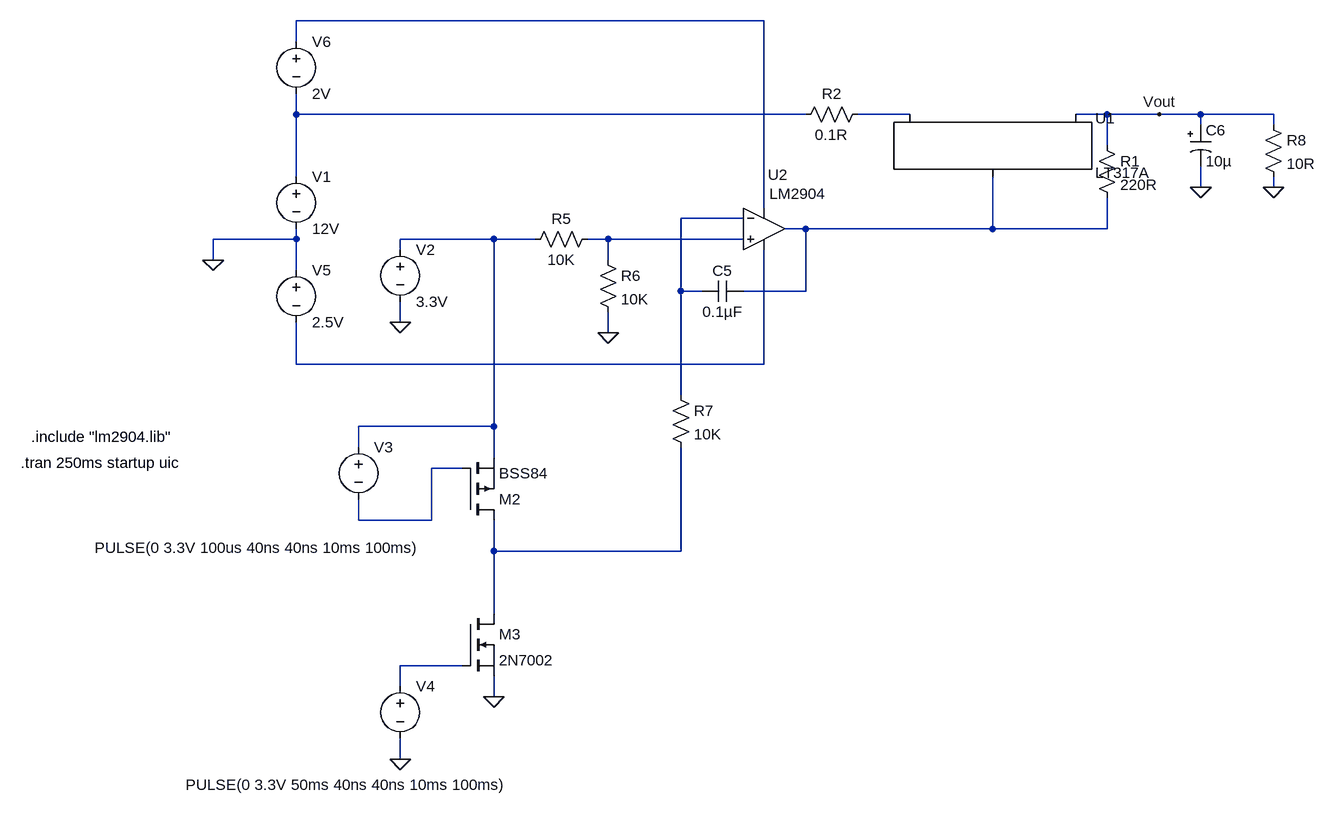
[diagram p0: schematic adj linear regulator minus current sense.asc]
adj linear regulator minus current sense.asc, the LTspice schematic file:
Version 4
SHEET 1 1336 820
WIRE 112 -512 -608 -512
WIRE -608 -480 -608 -512
WIRE -608 -368 -608 -400
WIRE 176 -368 -608 -368
WIRE 336 -368 256 -368
WIRE 640 -368 592 -368
WIRE 720 -368 640 -368
WIRE 784 -368 720 -368
WIRE 896 -368 784 -368
WIRE 784 -352 784 -368
WIRE 896 -352 896 -368
WIRE 640 -320 640 -368
WIRE -608 -272 -608 -368
WIRE 784 -256 784 -288
WIRE 896 -256 896 -272
WIRE 112 -224 112 -512
WIRE 80 -208 -16 -208
WIRE 176 -192 144 -192
WIRE 464 -192 464 -272
WIRE 464 -192 176 -192
WIRE 640 -192 640 -240
WIRE 640 -192 464 -192
WIRE -608 -176 -608 -192
WIRE -608 -176 -736 -176
WIRE -304 -176 -448 -176
WIRE -240 -176 -304 -176
WIRE -128 -176 -160 -176
WIRE 80 -176 -128 -176
WIRE -448 -160 -448 -176
WIRE -736 -144 -736 -176
WIRE -128 -144 -128 -176
WIRE -608 -128 -608 -176
WIRE -16 -96 -16 -208
WIRE 16 -96 -16 -96
WIRE 176 -96 176 -192
WIRE 176 -96 80 -96
WIRE -448 -48 -448 -80
WIRE -128 -32 -128 -64
WIRE -608 16 -608 -48
WIRE 112 16 112 -160
WIRE 112 16 -608 16
WIRE -16 64 -16 -96
WIRE -304 112 -304 -176
WIRE -304 112 -512 112
WIRE -512 144 -512 112
WIRE -304 160 -304 112
WIRE -352 176 -400 176
WIRE -512 256 -512 224
WIRE -400 256 -400 176
WIRE -400 256 -512 256
WIRE -304 304 -304 256
WIRE -16 304 -16 144
WIRE -16 304 -304 304
WIRE -304 400 -304 304
WIRE -352 480 -448 480
WIRE -448 512 -448 480
WIRE -304 528 -304 496
WIRE -448 624 -448 592
FLAG -736 -144 0
FLAG 720 -368 Vout
FLAG -448 -48 0
FLAG -128 -32 0
FLAG 784 -256 0
FLAG -304 528 0
FLAG -448 624 0
FLAG 896 -256 0
SYMBOL PowerProducts\\LT317A 464 -368 R0
SYMATTR InstName U1
SYMBOL voltage -608 -288 R0
WINDOW 123 0 0 Left 2
WINDOW 39 0 0 Left 2
SYMATTR InstName V1
SYMATTR Value 12V
SYMBOL res 624 -336 R0
SYMATTR InstName R1
SYMATTR Value 220R
SYMBOL Opamps\\opamp2 112 -256 R0
WINDOW 3 16 96 Invisible 2
WINDOW 38 8 10 Left 2
WINDOW 0 6 -19 Left 2
SYMATTR Value ""
SYMATTR SpiceModel LM2904
SYMATTR InstName U2
SYMBOL voltage -448 -176 R0
WINDOW 123 0 0 Left 2
WINDOW 39 0 0 Left 2
SYMATTR InstName V2
SYMATTR Value 3.3V
SYMBOL res 272 -384 R90
WINDOW 0 0 56 VBottom 2
WINDOW 3 32 56 VTop 2
SYMATTR InstName R2
SYMATTR Value 0.1R
SYMBOL res -144 -192 R90
WINDOW 0 0 56 VBottom 2
WINDOW 3 32 56 VTop 2
SYMATTR InstName R5
SYMATTR Value 10K
SYMBOL res -144 -160 R0
SYMATTR InstName R6
SYMATTR Value 10K
SYMBOL cap 80 -112 R90
WINDOW 0 0 32 VBottom 2
WINDOW 3 32 32 VTop 2
SYMATTR InstName C5
SYMATTR Value 0.1µF
SYMBOL polcap 768 -352 R0
WINDOW 3 24 56 Left 2
SYMATTR Value 10µ
SYMATTR InstName C6
SYMATTR Description Capacitor
SYMATTR Type cap
SYMATTR SpiceLine V=16 Irms=35m Rser=2.8 Lser=0 mfg="Nichicon" pn="UPR1C100MAH" type="Al electrolytic"
SYMBOL pmos -352 256 M180
SYMATTR InstName M2
SYMATTR Value BSS84
SYMBOL nmos -352 400 R0
SYMATTR InstName M3
SYMATTR Value 2N7002
SYMBOL voltage -512 128 R0
WINDOW 123 0 0 Left 2
WINDOW 39 0 0 Left 2
WINDOW 3 -406 171 Left 2
SYMATTR Value PULSE(0 3.3V 100us 40ns 40ns 10ms 100ms)
SYMATTR InstName V3
SYMBOL voltage -448 496 R0
WINDOW 123 0 0 Left 2
WINDOW 39 0 0 Left 2
WINDOW 3 -330 167 Left 2
SYMATTR Value PULSE(0 3.3V 50ms 40ns 40ns 10ms 100ms)
SYMATTR InstName V4
SYMBOL res -32 48 R0
SYMATTR InstName R7
SYMATTR Value 10K
SYMBOL res 880 -368 R0
SYMATTR InstName R8
SYMATTR Value 10R
SYMBOL voltage -608 -144 R0
WINDOW 123 0 0 Left 2
WINDOW 39 0 0 Left 2
SYMATTR InstName V5
SYMATTR Value 2.5V
SYMBOL voltage -608 -496 R0
WINDOW 123 0 0 Left 2
WINDOW 39 0 0 Left 2
SYMATTR InstName V6
SYMATTR Value 2V
TEXT -1016 128 Left 2 !.include "lm2904.lib"
TEXT -1032 168 Left 2 !.tran 250ms startup uic

The netlist it stands for:
* adj linear regulator minus current sense.asc
XU1 N005 Vout N003 LT317A
V1 N002 0 12V
R1 Vout N005 220R
XU2 N007 N004 N001 N008 N005 LM2904  ; pins In+ In- V+ V- OUT
V2 N006 0 3.3V
R2 N003 N002 0.1R
R5 N007 N006 10K
R6 N007 0 10K
C5 N005 N004 0.1µF
C6 Vout 0 10µ V=16 Irms=35m Rser=2.8 Lser=0 mfg="Nichicon" pn="UPR1C100MAH" type="Al electrolytic"
M2 N010 N009 N006 N006 BSS84
M3 N010 N011 0 0 2N7002
V3 N006 N009 PULSE(0 3.3V 100us 40ns 40ns 10ms 100ms)
V4 N011 0 PULSE(0 3.3V 50ms 40ns 40ns 10ms 100ms)
R7 N004 N010 10K
R8 Vout 0 10R
V5 0 N008 2.5V
V6 N001 N002 2V
.model NMOS NMOS
.model PMOS PMOS
.lib standard.mos
.include "lm2904.lib"
.tran 250ms startup uic
.lib LTC.lib
.backanno
.end